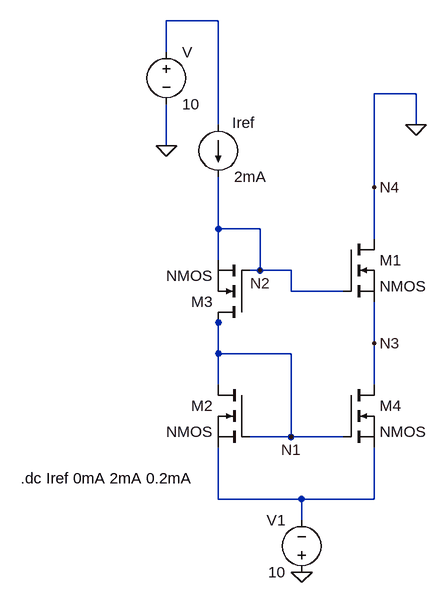
[diagram p0: schematic MOS current Mirror (Prac2).asc]
MOS current Mirror (Prac2).asc, the LTspice schematic file:
Version 4
SHEET 1 880 756
WIRE 192 -112 112 -112
WIRE 112 -64 112 -112
WIRE 496 0 432 0
WIRE 192 48 192 -112
WIRE 496 48 496 0
WIRE 112 80 112 16
WIRE 432 144 432 0
WIRE 192 208 192 128
WIRE 256 208 192 208
WIRE 432 224 432 144
WIRE 192 256 192 208
WIRE 256 272 256 208
WIRE 256 272 240 272
WIRE 304 272 256 272
WIRE 304 304 304 272
WIRE 384 304 304 304
WIRE 192 352 192 336
WIRE 432 384 432 320
WIRE 192 400 192 352
WIRE 304 400 192 400
WIRE 192 448 192 400
WIRE 432 448 432 384
WIRE 304 528 304 400
WIRE 304 528 240 528
WIRE 384 528 304 528
WIRE 192 624 192 544
WIRE 320 624 192 624
WIRE 432 624 432 544
WIRE 432 624 320 624
WIRE 320 656 320 624
FLAG 112 80 0
FLAG 320 736 0
FLAG 496 48 0
FLAG 304 528 N1
FLAG 256 272 N2
FLAG 432 144 N4
FLAG 432 384 N3
SYMBOL current 192 48 R0
WINDOW 0 21 -3 Left 2
SYMATTR InstName Iref
SYMATTR Value 2mA
SYMBOL voltage 112 -80 R0
SYMATTR InstName V
SYMATTR Value 10
SYMBOL nmos 384 224 R0
SYMATTR InstName M1
SYMBOL nmos 240 448 M0
SYMATTR InstName M2
SYMBOL nmos 240 352 R180
SYMATTR InstName M3
SYMBOL nmos 384 448 R0
SYMATTR InstName M4
SYMBOL voltage 320 752 R180
WINDOW 0 24 96 Left 2
WINDOW 3 24 16 Left 2
SYMATTR InstName V1
SYMATTR Value 10
TEXT -112 592 Left 2 !.dc Iref 0mA 2mA 0.2mA

The netlist it stands for:
* MOS current Mirror (Prac2).asc
Iref N001 N2 2mA
V N001 0 10
M1 0 N2 N3 N3 NMOS
M2 N1 N1 N002 N002 NMOS
M3 N1 N2 N2 N2 NMOS
M4 N3 N1 N002 N002 NMOS
V1 0 N002 10
.model NMOS NMOS
.model PMOS PMOS
.lib standard.mos
.dc Iref 0mA 2mA 0.2mA
.backanno
.end

* Results of the author's LTspice run, read from the files saved beside the schematic
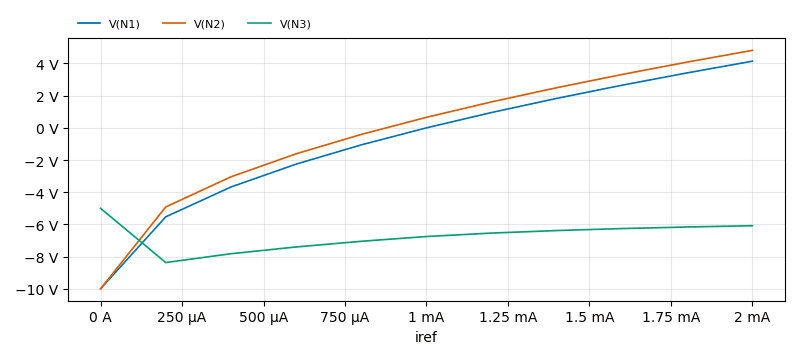
[diagram p1: DC transfer characteristic of MOS current Mirror (Prac2).asc, plotted from the saved traces]
* DC transfer characteristic, 1 run:
*   V(N1): -10 V at iref=0 A, 4.142 V at iref=2 mA, min -10 V, max 4.142 V
*   V(N2): -9.999 V at iref=0 A, 4.815 V at iref=2 mA, min -9.999 V, max 4.815 V
*   V(N3): -5 V at iref=0 A, -6.08 V at iref=2 mA, min -8.368 V, max -5 V